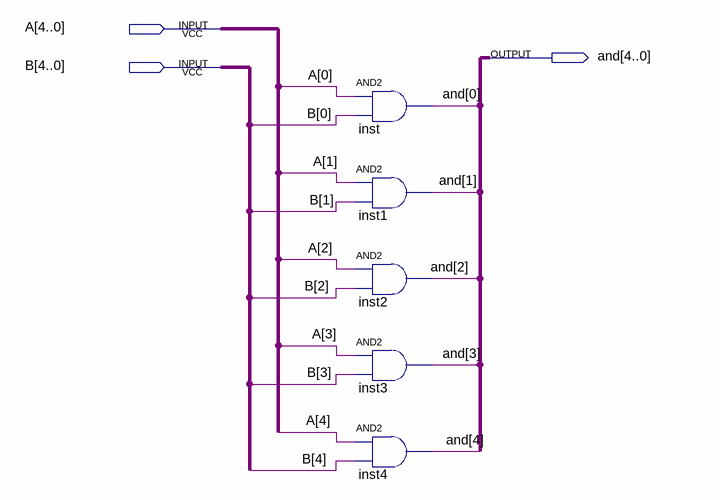
[diagram p0: schematic sheet]
// Quartus schematic FuncaoAND.bdf as structural Verilog: 5 symbols, 3 pins
module FuncaoAND (
  input  [4:0] A,
  input  [4:0] B,
  output [4:0] \and 
);

  and inst (\and [0], A[0], B[0]);
  and inst1 (\and [1], A[1], B[1]);
  and inst2 (\and [2], A[2], B[2]);
  and inst3 (\and [3], A[3], B[3]);
  and inst4 (\and [4], A[4], B[4]);
endmodule
